# Altium schematic sheet LVDS2RGB_DS90C384A.SchDoc
size A3
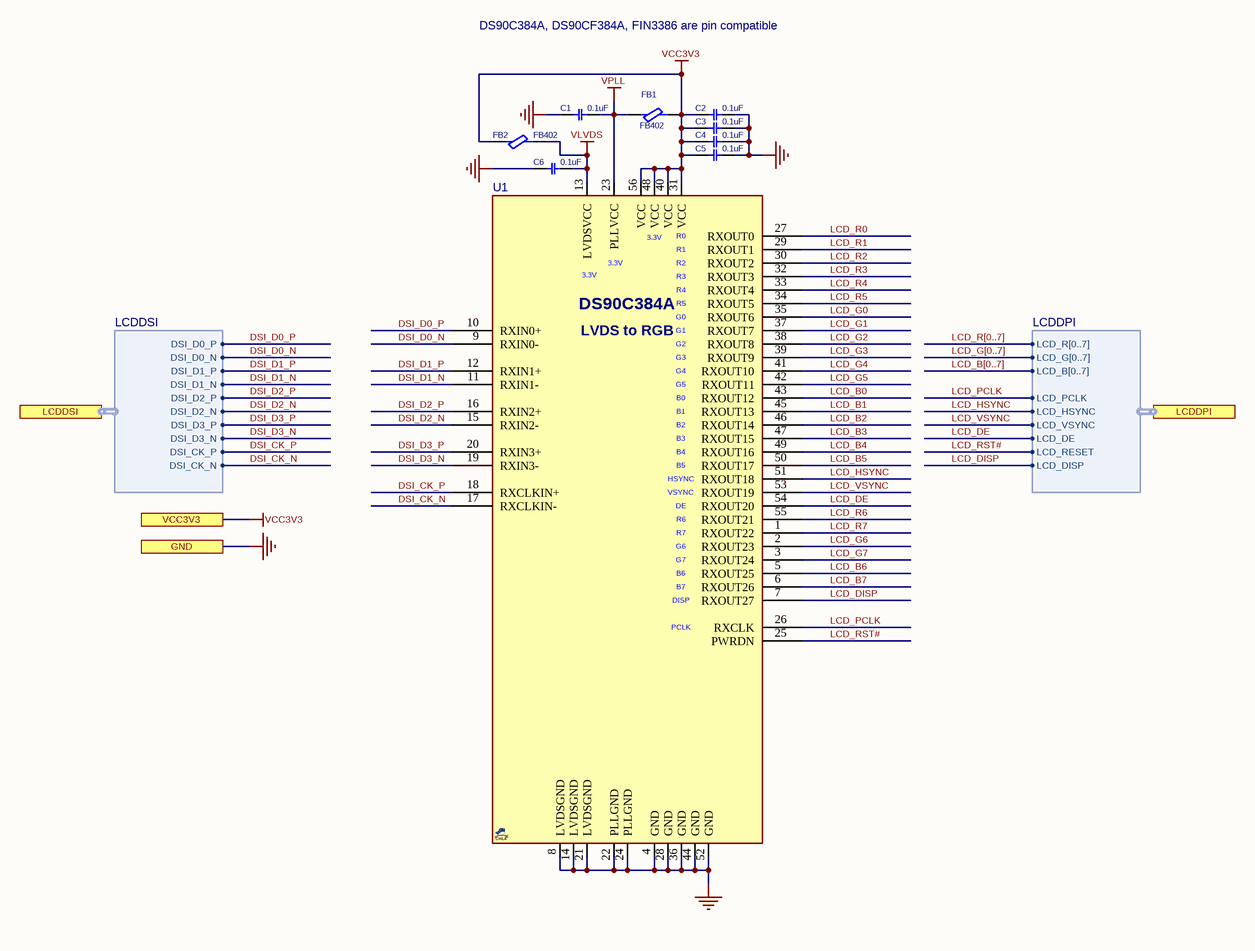
[diagram p0: LVDS2RGB_DS90C384A.SchDoc]

## Parts
C1  0.1uF  [C0402]
C2  0.1uF  [C0402]
C3  0.1uF  [C0402]
C4  0.1uF  [C0402]
C5  0.1uF  [C0402]
C6  0.1uF  [C0402]
FB1  FB402  [L0402]
FB2  FB402  [L0402]
U1  DS90C384A  [SOG50_56]  (value not drawn)

## Ports
GND, LCDDPI (harness LCDDPI), LCDDSI (harness LCDDSI), VCC3V3

## Harnesses
LCDDSI: DSI_D0_P, DSI_D0_N, DSI_D1_P, DSI_D1_N, DSI_D2_P, DSI_D2_N, DSI_D3_P, DSI_D3_N, DSI_CK_P, DSI_CK_N
LCDDPI: LCD_PCLK, LCD_HSYNC, LCD_VSYNC, LCD_DE, LCD_R[0..7], LCD_G[0..7], LCD_B[0..7], LCD_RESET, LCD_DISP

## Nets
GND: C1.2 C2.1 C3.1 C4.1 C5.1 C6.2 U1.4(GND) U1.8(LVDSGND) U1.14(LVDSGND) U1.21(LVDSGND) U1.22(PLLGND) U1.24(PLLGND) U1.28(GND) U1.36(GND) U1.44(GND) U1.52(GND) ; port GND
VCC3V3: C2.2 C3.2 C4.2 C5.2 FB1.2 FB2.1 U1.31(VCC) U1.40(VCC) U1.48(VCC) U1.56(VCC) ; port VCC3V3
VLVDS: C6.1 FB2.2 U1.13(LVDSVCC)
VPLL: C1.1 FB1.1 U1.23(PLLVCC)
DSI_CK_N: U1.17(RXCLKIN-) ; port LCDDSI.DSI_CK_N
DSI_CK_P: U1.18(RXCLKIN+) ; port LCDDSI.DSI_CK_P
DSI_D0_N: U1.9(RXIN0-) ; port LCDDSI.DSI_D0_N
DSI_D0_P: U1.10(RXIN0+) ; port LCDDSI.DSI_D0_P
DSI_D1_N: U1.11(RXIN1-) ; port LCDDSI.DSI_D1_N
DSI_D1_P: U1.12(RXIN1+) ; port LCDDSI.DSI_D1_P
DSI_D2_N: U1.15(RXIN2-) ; port LCDDSI.DSI_D2_N
DSI_D2_P: U1.16(RXIN2+) ; port LCDDSI.DSI_D2_P
DSI_D3_N: U1.19(RXIN3-) ; port LCDDSI.DSI_D3_N
DSI_D3_P: U1.20(RXIN3+) ; port LCDDSI.DSI_D3_P
LCD_B0: U1.43(RXOUT12)
LCD_B1: U1.45(RXOUT13)
LCD_B2: U1.46(RXOUT14)
LCD_B3: U1.47(RXOUT15)
LCD_B4: U1.49(RXOUT16)
LCD_B5: U1.50(RXOUT17)
LCD_B6: U1.5(RXOUT25)
LCD_B7: U1.6(RXOUT26)
LCD_DE: U1.54(RXOUT20) ; port LCDDPI.LCD_DE
LCD_DISP: U1.7(RXOUT27) ; port LCDDPI.LCD_DISP
LCD_G0: U1.35(RXOUT6)
LCD_G1: U1.37(RXOUT7)
LCD_G2: U1.38(RXOUT8)
LCD_G3: U1.39(RXOUT9)
LCD_G4: U1.41(RXOUT10)
LCD_G5: U1.42(RXOUT11)
LCD_G6: U1.2(RXOUT23)
LCD_G7: U1.3(RXOUT24)
LCD_HSYNC: U1.51(RXOUT18) ; port LCDDPI.LCD_HSYNC
LCD_PCLK: U1.26(RXCLK) ; port LCDDPI.LCD_PCLK
LCD_R0: U1.27(RXOUT0)
LCD_R1: U1.29(RXOUT1)
LCD_R2: U1.30(RXOUT2)
LCD_R3: U1.32(RXOUT3)
LCD_R4: U1.33(RXOUT4)
LCD_R5: U1.34(RXOUT5)
LCD_R6: U1.55(RXOUT21)
LCD_R7: U1.1(RXOUT22)
LCD_RST#: U1.25(PWRDN) ; port LCDDPI.LCD_RESET
LCD_VSYNC: U1.53(RXOUT19) ; port LCDDPI.LCD_VSYNC

## Buses and harness runs
bus LCD_B[0..7]
bus LCD_G[0..7]
bus LCD_R[0..7]

## Notes on the sheet
- DS90C384A, DS90CF384A, FIN3386 are pin compatible
- (in symbol DS90C384A_TSSOP56) R0; R1; R2; R3; R4; R5; G0; LVDS to RGB; G1; G2; G3; G4; G5; B0; B1; B2; B3; B4; B5; HSYNC; VSYNC; DE; R6; R7; G6; G7; B6; B7; DISP; PCLK

## Library data of the parts
C1-C6 = CAP_SMD_MLCC: CAP, MLCC; PARAM: X7R, 10%, -55~125oC; MANF_P#: GRM155R71H104KE14D; MANF: Murata; PARAM2: 50v; PRICE: 100: 0.018$; ASSEMBLY: ASSEMBLY; VALUE: 0.1uF
FB1 FB2 = FBEAD_SMD_BLM15PD121: FERRITE_Bead, 0402, 0.5A, 200mOhm, 120@100MHz; MANF: MURATA; MANF_P#: BLM15AG121SN1D; PARAM: 120@100MHz; PARAM2: 0.5A, 200mOhm; VALUE: FB402
U1 = DS90C384A_TSSOP56: LVDS receiver, RGB transmitter; MANF: Texas Instruments; MANF_P#: DS90C384AMT; PARAM2: 3.3V; PARAM: -; PRICE: 5$; VALUE: DS90C384A